# Altium schematic sheet QCopterFC_CAMSPI_Sch.SchDoc
size A4
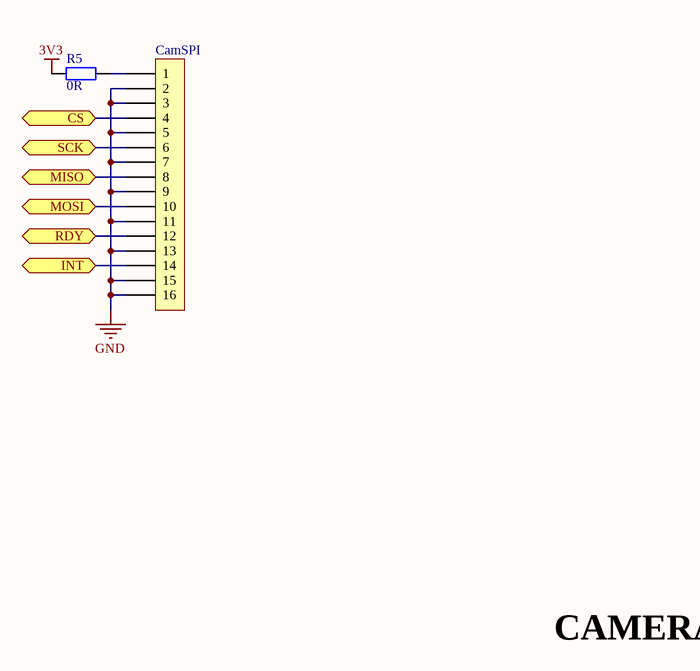
[diagram p0: QCopterFC_CAMSPI_Sch.SchDoc]

## Parts
CamSPI  FFC_0.5_16  [FFC_0.5_16]  (value not drawn)
R5  value 0R  [RES_0603]  (hidden comment: Res_0603)

## Ports
CS, INT, MISO, MOSI, RDY, SCK

## Nets
3V3: R5.1
GND: CamSPI.2 CamSPI.3 CamSPI.5 CamSPI.7 CamSPI.9 CamSPI.11 CamSPI.13 CamSPI.15 CamSPI.16
CS: CamSPI.4 ; port CS
INT: CamSPI.14 ; port INT
MISO: CamSPI.8 ; port MISO
MOSI: CamSPI.10 ; port MOSI
RDY: CamSPI.12 ; port RDY
SCK: CamSPI.6 ; port SCK
NetCamSPI_1: CamSPI.1 R5.2

## Notes on the sheet
- CAMERA

## Library data of the parts
CamSPI = FFC_0.5_16: FFC
R5 = Res_0603: Resistor